# Altium schematic sheet PrintNC_CNC_Breakout.SchDoc
size C; Author: AM; CompanyName: Expatria Technologies; DrawnBy: A.Marles; Engineer: AM; Organization: Expatria Technologies; Address1: Schematic; Address2: 101 Main Street, 14th Floor; Address3: Cambridge, MA 02142; Address4: USA; DocumentNumber: 3; SheetNumber: 3; SheetTotal: 14; PCB_Rev: A1
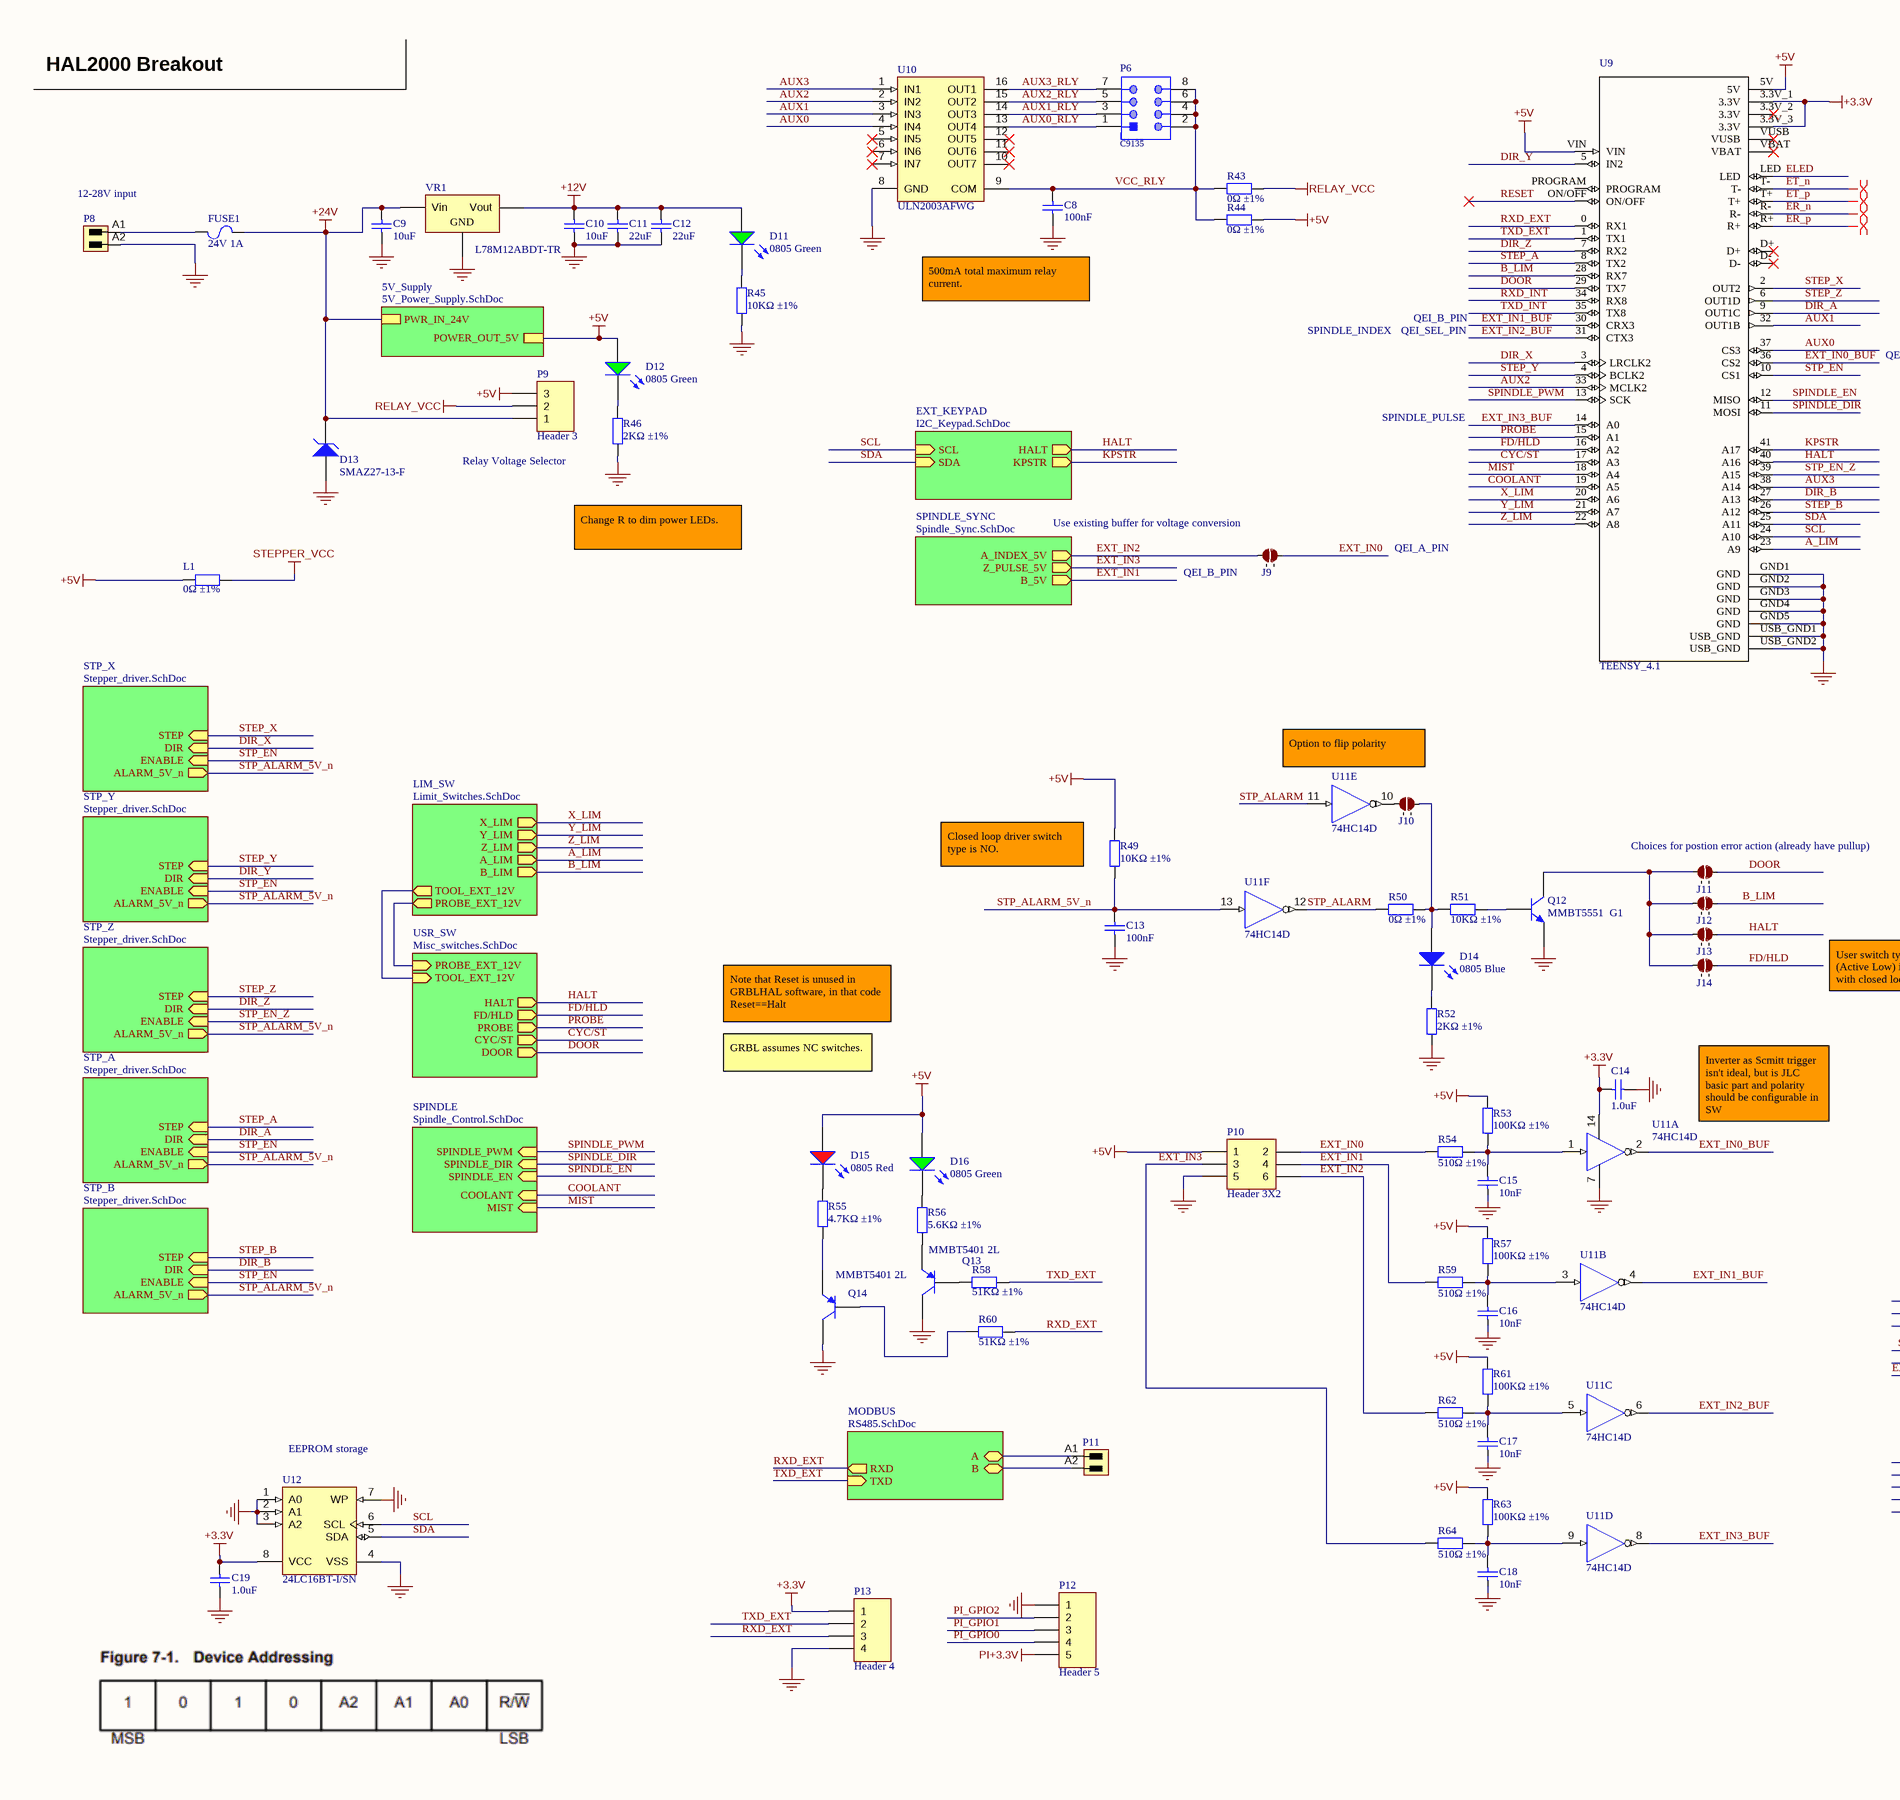
[diagram p0: PrintNC_CNC_Breakout.SchDoc, left]
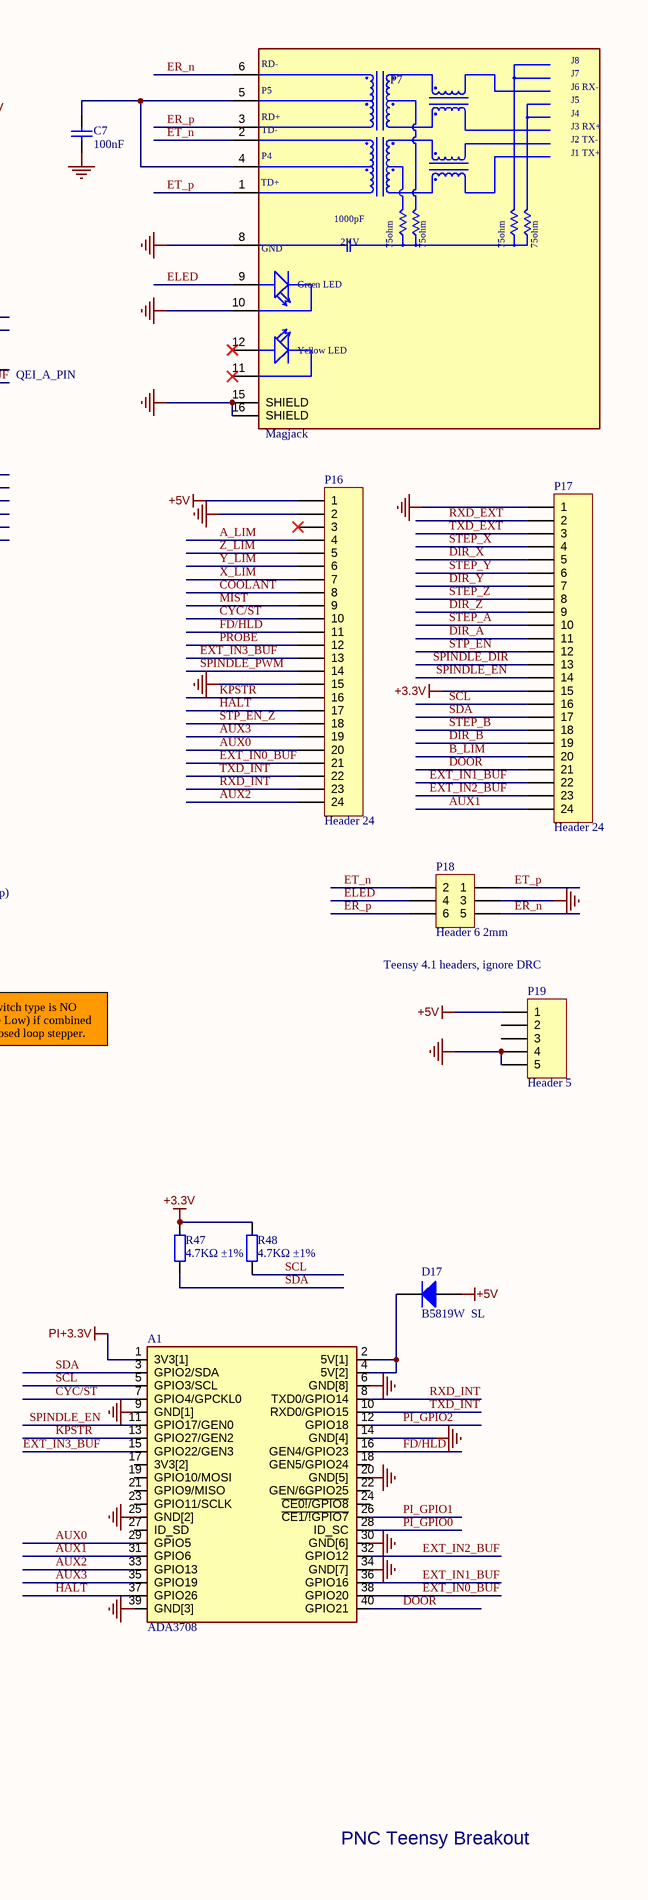
[diagram p1: PrintNC_CNC_Breakout.SchDoc, right]

## Parts
A1  ADA3708  [ADA3708_RPI-ZERO]
C7  100nF  [1206_C]
C8  100nF  [0603_C]
C9  10uF  [1206_C]
C10  10uF  [1206_C]
C11  22uF  [0805_C]
C12  22uF  [0805_C]
C13  100nF  [0402_C]
C14  1.0uF  [0402_C]
C15  10nF  [0402_C]
C16  10nF  [0402_C]
C17  10nF  [0402_C]
C18  10nF  [0402_C]
C19  1.0uF  [0402_C]
D11  0805 Green  [0805_LED_S1]
D12  0805 Green  [0805_LED_S1]
D13  SMAZ27-13-F  [DIOM5226X240N]
D14  0805 Blue  [0805_LED_S1]
D15  0805 Red  [0805_LED_S1]
D16  0805 Green  [0805_LED_S1]
D17  B5819W  SL  [SOD-123]
FUSE1  24V 1A  [1206_C]
J9  2 way net solder junction - Normally Open  [2waySolder_NO]  (value not drawn)  (no BOM)
J10  2 way net solder junction - Normally Open  [2waySolder_NO]  (value not drawn)  (no BOM)
J11  2 way net solder junction - Normally Open  [2waySolder_NO]  (value not drawn)  (no BOM)
J12  2 way net solder junction - Normally Open  [2waySolder_NO]  (value not drawn)  (no BOM)
J13  2 way net solder junction - Normally Open  [2waySolder_NO]  (value not drawn)  (no BOM)
J14  2 way net solder junction - Normally Open  [2waySolder_NO]  (value not drawn)  (no BOM)
L1  0Ω ±1%  [0402_R]
P6  C9135  [61200821621]
P7  Magjack  [HANRUN_HR911105A]
P8  (no value)  [SL_3_50_180G_02]
P9  Header 3  [HDR1X3]
P10  Header 3X2  [HDR2X3]
P11  (no value)  [SL_3_50_180G_02]
P12  Header 5  [HDR1X5]
P13  Header 4  [HDR1X4]  (no BOM)
P16  Header 24  [HDR1X24]  (no BOM)
P17  Header 24  [HDR1X24]  (no BOM)
P18  Header 6 2mm  [HDR2X3 - 2mm]
P19  Header 5  [HDR1X5]  (no BOM)
Q12  MMBT5551  G1  [SOT-23(SOT-23-3)]
Q13  MMBT5401 2L  [SOT-23(SOT-23-3)]
Q14  MMBT5401 2L  [SOT-23(SOT-23-3)]
R43  0Ω ±1%  [0402_R]
R44  0Ω ±1%  [0402_R]  (no BOM)
R45  10KΩ ±1%  [0402_R]
R46  2KΩ ±1%  [0402_R]
R47  4.7KΩ ±1%  [0402_R]
R48  4.7KΩ ±1%  [0402_R]
R49  10KΩ ±1%  [0402_R]
R50  0Ω ±1%  [0402_R]
R51  10KΩ ±1%  [0402_R]
R52  2KΩ ±1%  [0402_R]
R53  100KΩ ±1%  [0402_R]
R54  510Ω ±1%  [0402_R]
R55  4.7KΩ ±1%  [0402_R]
R56  5.6KΩ ±1%  [0402_R]
R57  100KΩ ±1%  [0402_R]
R58  51KΩ ±1%  [0402_R]
R59  510Ω ±1%  [0402_R]
R60  51KΩ ±1%  [0402_R]
R61  100KΩ ±1%  [0402_R]
R62  510Ω ±1%  [0402_R]
R63  100KΩ ±1%  [0402_R]
R64  510Ω ±1%  [0402_R]
U9  TEENSY_4.1  [TEENSY4-1]  (no BOM)
U10  ULN2003AFWG  [SOIC-16_150mil]
U11  74HC14D  [SOIC-14_150mil]  (parts A,B,C,D,E,F of 6)
U12  24LC16BT-I/SN  [SOIC-SN8_L]
VR1  L78M12ABDT-TR  [TO-252-2-180]

## Sub-sheets
5V_Supply = 5V_Power_Supply.SchDoc: POWER_OUT_5V, PWR_IN_24V
EXT_KEYPAD = I2C_Keypad.SchDoc: HALT (out), SCL (in), KPSTR (out), SDA (in)
LIM_SW = Limit_Switches.SchDoc: Y_LIM (out), Z_LIM (out), X_LIM (out), A_LIM (out), B_LIM (out), TOOL_EXT_12V (out), PROBE_EXT_12V (out)
MODBUS = RS485.SchDoc: A (bidir), B (bidir), RXD (out), TXD (in)
SPINDLE = Spindle_Control.SchDoc: SPINDLE_DIR (in), COOLANT (in), SPINDLE_PWM (in), SPINDLE_EN (in), MIST (in)
SPINDLE_SYNC = Spindle_Sync.SchDoc: Z_PULSE_5V (out), A_INDEX_5V (out), B_5V (out)
STP_A = Stepper_driver.SchDoc: ALARM_5V_n (out), STEP (in), DIR (in), ENABLE (in)
STP_B = Stepper_driver.SchDoc: STEP (in), DIR (in), ENABLE (in), ALARM_5V_n (out)
STP_X = Stepper_driver.SchDoc: ALARM_5V_n (out), STEP (in), DIR (in), ENABLE (in)
STP_Y = Stepper_driver.SchDoc: ALARM_5V_n (out), STEP (in), DIR (in), ENABLE (in)
STP_Z = Stepper_driver.SchDoc: ALARM_5V_n (out), STEP (in), DIR (in), ENABLE (in)
USR_SW = Misc_switches.SchDoc: HALT (out), FD/HLD (out), PROBE (out), CYC/ST (out), DOOR (out), TOOL_EXT_12V (in), PROBE_EXT_12V (in)

## Nets
+3.3V: C14.1 C19.2 P13.1 P17.15 R47.2 R48.2 U9.3.3V_1(3.3V) U9.3.3V_3(3.3V) U11.14(VDD) U12.8(VCC)
+5V: D12.A D15.A D16.A D17.1(A) L1.1 P9.3 P10.1 P16.1 P19.1 R44.1 R49.2 R53.2 R57.2 R61.2 R63.2 U9.5V U9.VIN ; sheet 5V_Supply/POWER_OUT_5V
+12V: C10.2 C11.2 C12.2 D11.A VR1.3(Vout)
+24V: C9.2 D13.2(K) FUSE1.2 P9.1 VR1.1(Vin) ; sheet 5V_Supply/PWR_IN_24V
GND: A1.6(GND[8]) A1.9(GND[1]) A1.14(GND[4]) A1.20(GND[5]) A1.25(GND[2]) A1.30(GND[6]) A1.34(GND[7]) A1.39(GND[3]) C7.1 C8.1 C9.1 C10.1 C11.1 C12.1 C13.1 C14.2 C15.1 C16.1 C17.1 C18.1 C19.1 D13.1(A) P7.8(GND) P7.10(GC) P7.15(SHIELD) P7.16(SHIELD) P8.A2 P10.5 P12.1 P13.4 P16.2 P16.15 P17.1 P18.3 P19.4 P19.5 Q12.2(E) Q13.3(C) Q14.3(C) R45.1 R46.1 R52.1 U9.GND1(GND) U9.GND2(GND) U9.GND3(GND) U9.GND4(GND) U9.GND5(GND) U9.USB_GND1(USB_GND) U9.USB_GND2(USB_GND) U10.8(GND) U11.7(GND) U12.1(A0) U12.2(A1) U12.3(A2) U12.4(VSS) U12.7(WP) VR1.2(GND)
PI+3.3V: A1.1(3V3[1]) P12.5
RELAY_VCC: P9.2 R43.1
STEPPER_VCC: L1.2
A_LIM: P16.4 U9.23(A9) ; sheet LIM_SW/A_LIM
AUX0: A1.29(GPIO5) P16.20 U9.37(CS3) U10.4(IN4)
AUX0_RLY: P6.1 U10.13(OUT4)
AUX1: A1.31(GPIO6) P17.24 U9.32(OUT1B) U10.3(IN3)
AUX1_RLY: P6.3 U10.14(OUT3)
AUX2: A1.33(GPIO13) P16.24 U9.33(MCLK2) U10.2(IN2)
AUX2_RLY: P6.5 U10.15(OUT2)
AUX3: A1.35(GPIO19) P16.19 U9.38(A14) U10.1(IN1)
AUX3_RLY: P6.7 U10.16(OUT1)
B_LIM: J12.2 P17.20 U9.28(RX7) ; sheet LIM_SW/B_LIM
COOLANT: P16.8 U9.19(A5) ; sheet SPINDLE/COOLANT
CYC/ST: A1.7(GPIO4/GPCKL0) P16.10 U9.17(A3) ; sheet USR_SW/CYC/ST
DIR_A: P17.11 U9.9(OUT1C) ; sheet STP_A/DIR
DIR_B: P17.19 U9.27(A13) ; sheet STP_B/DIR
DIR_X: P17.5 U9.3(LRCLK2) ; sheet STP_X/DIR
DIR_Y: P17.7 U9.5(IN2) ; sheet STP_Y/DIR
DIR_Z: P17.9 U9.7(RX2) ; sheet STP_Z/DIR
DOOR: A1.40(GPIO21) J11.2 P17.21 U9.29(TX7) ; sheet USR_SW/DOOR
ELED: P7.9(GA) P18.4 U9.LED
ER_n: P7.6(RD-) P18.5 U9.R-
ER_p: P7.3(RD+) P18.6 U9.R+
ET_n: P7.2(TD-) P18.2 U9.T-
ET_p: P7.1(TD+) P18.1 U9.T+
EXT_IN0: J9.2 P10.2 R54.1
EXT_IN0_BUF: A1.38(GPIO20) P16.21 U9.36(CS2) U11.2(Y)
EXT_IN1: P10.4 R59.1 ; sheet SPINDLE_SYNC/B_5V
EXT_IN1_BUF: A1.36(GPIO16) P17.22 U9.30(CRX3) U11.4(Y)
EXT_IN2: J9.1 P10.6 R62.1 ; sheet SPINDLE_SYNC/A_INDEX_5V
EXT_IN2_BUF: A1.32(GPIO12) P17.23 U9.31(CTX3) U11.6(Y)
EXT_IN3: P10.3 R64.1 ; sheet SPINDLE_SYNC/Z_PULSE_5V
EXT_IN3_BUF: A1.15(GPIO22/GEN3) P16.13 U9.14(A0) U11.8(Y)
FD/HLD: A1.16(GEN4/GPIO23) J14.2 P16.11 U9.16(A2) ; sheet USR_SW/FD/HLD
HALT: A1.37(GPIO26) J13.2 P16.17 U9.40(A16) ; sheet USR_SW/HALT, sheet EXT_KEYPAD/HALT
KPSTR: A1.13(GPIO27/GEN2) P16.16 U9.41(A17) ; sheet EXT_KEYPAD/KPSTR
MIST: P16.9 U9.18(A4) ; sheet SPINDLE/MIST
PI_GPIO0: A1.28(ID_SC) P12.4
PI_GPIO1: A1.26(~{CE1/!GPIO7}) P12.3
PI_GPIO2: A1.12(GPIO18) P12.2
PROBE: P16.12 U9.15(A1) ; sheet USR_SW/PROBE
RESET: U9.ON/OFF
RXD_EXT: P13.3 P17.2 R60.1 U9.0(RX1) ; sheet MODBUS/RXD
RXD_INT: A1.8(TXD0/GPIO14) P16.23 U9.34(RX8)
SCL: A1.5(GPIO3/SCL) P17.16 R48.1 U9.24(A10) U12.6(SCL) ; sheet EXT_KEYPAD/SCL
SDA: A1.3(GPIO2/SDA) P17.17 R47.1 U9.25(A11) U12.5(SDA) ; sheet EXT_KEYPAD/SDA
SPINDLE_DIR: P17.13 U9.11(MOSI) ; sheet SPINDLE/SPINDLE_DIR
SPINDLE_EN: A1.11(GPIO17/GEN0) P17.14 U9.12(MISO) ; sheet SPINDLE/SPINDLE_EN
SPINDLE_PWM: P16.14 U9.13(SCK) ; sheet SPINDLE/SPINDLE_PWM
STEP_A: P17.10 U9.8(TX2) ; sheet STP_A/STEP
STEP_B: P17.18 U9.26(A12) ; sheet STP_B/STEP
STEP_X: P17.4 U9.2(OUT2) ; sheet STP_X/STEP
STEP_Y: P17.6 U9.4(BCLK2) ; sheet STP_Y/STEP
STEP_Z: P17.8 U9.6(OUT1D) ; sheet STP_Z/STEP
STP_ALARM: R50.2 U11.11(A) U11.12(Y)
STP_ALARM_5V_n: C13.2 R49.1 U11.13(A) ; sheet STP_X/ALARM_5V_n, sheet STP_Y/ALARM_5V_n, sheet STP_Z/ALARM_5V_n, sheet STP_A/ALARM_5V_n, sheet STP_B/ALARM_5V_n
STP_EN: P17.12 U9.10(CS1) ; sheet STP_X/ENABLE, sheet STP_Y/ENABLE, sheet STP_A/ENABLE, sheet STP_B/ENABLE
STP_EN_Z: P16.18 U9.39(A15) ; sheet STP_Z/ENABLE
TXD_EXT: P13.2 P17.3 R58.2 U9.1(TX1) ; sheet MODBUS/TXD
TXD_INT: A1.10(RXD0/GPIO15) P16.22 U9.35(TX8)
VCC_RLY: C8.2 P6.2 P6.4 P6.6 P6.8 R43.2 R44.2 U10.9(COM)
X_LIM: P16.7 U9.20(A6) ; sheet LIM_SW/X_LIM
Y_LIM: P16.6 U9.21(A7) ; sheet LIM_SW/Y_LIM
Z_LIM: P16.5 U9.22(A8) ; sheet LIM_SW/Z_LIM
NetA1_2: A1.2(5V[1]) A1.4(5V[2]) D17.2(K)
NetC7_2: C7.2 P7.4(P4) P7.5(P5)
NetC15_2: C15.2 R53.1 R54.2 U11.1(A)
NetC16_2: C16.2 R57.1 R59.2 U11.3(A)
NetC17_2: C17.2 R61.1 R62.2 U11.5(A)
NetC18_2: C18.2 R63.1 R64.2 U11.9(A)
NetD11_K: D11.K R45.2
NetD12_K: D12.K R46.2
NetD14_A: D14.A J10.2 R50.1 R51.1
NetD14_K: D14.K R52.2
NetD15_K: D15.K R55.2
NetD16_K: D16.K R56.2
NetFUSE1_1: FUSE1.1 P8.A1
NetJ10_1: J10.1 U11.10(Y)
NetJ11_1: J11.1 J12.1 J13.1 J14.1 Q12.3(C)
NetP11_A1: P11.A1 ; sheet MODBUS/A
NetP11_A2: P11.A2 ; sheet MODBUS/B
NetQ12_1: Q12.1(B) R51.2
NetQ13_1: Q13.1(B) R58.1
NetQ13_2: Q13.2(E) R56.1
NetQ14_1: Q14.1(B) R60.2
NetQ14_2: Q14.2(E) R55.1
(unnamed): sheet LIM_SW/TOOL_EXT_12V, sheet USR_SW/TOOL_EXT_12V
(unnamed): sheet LIM_SW/PROBE_EXT_12V, sheet USR_SW/PROBE_EXT_12V

Not connected (* = marked no-connect by the designer): A1 17(3V3[2]) 18(GEN5/GPIO24) 19(GPIO10/MOSI) 21(GPIO9/MISO) 22(GEN/6GPIO25) 23(GPIO11/SCLK) 24(~{CE0!/GPIO8}) 27(ID_SD); P7 11(YC)* 12(YA)*; P16 3*; P19 2 3; U9 3.3V_2(3.3V)* D+* D-* PROGRAM VBAT* VUSB*; U10 5(IN5)* 6(IN6)* 7(IN7)* 10(OUT7)* 11(OUT6)* 12(OUT5)*

## Layout directives
differential pair: ER_n, ER_p, ET_n, ET_p

## Notes on the sheet
- HAL2000 Breakout
- (near P8) 12-28V input
- 500mA total maximum relay current.
- SPINDLE_INDEX
- QEI_SEL_PIN
- QEI_B_PIN
- QEI_A_PIN
- SPINDLE_PULSE
- Relay Voltage Selector
- (near J9) Use existing buffer for voltage conversion
- Change R to dim power LEDs.
- (near J9) QEI_B_PIN
- Option to flip polarity
- (near R49) Closed loop driver switch type is NO.
- (near J11) Choices for postion error action (already have pullup)
- Teensy 4.1 headers, ignore DRC
- Note that Reset is unused in GRBLHAL software, in that code Reset==Halt
- User switch type is NO (Active Low) if combined with closed loop stepper.
- GRBL assumes NC switches.
- Inverter as Scmitt trigger isn't ideal, but is JLC basic part and polarity should be configurable in SW
- (near U12) EEPROM storage
- PNC Teensy Breakout
- Expatria Technologies
- SHEET
- PROJECT
- REV
- 1136 Glade Court
- Port Coquitlam, BC V3B 1R5
- EMAIL: INFO@EXPATRIA.CA
- SIZE
- ENGR
- C
- MODIFIED
- DOCUMENT
- /
- Copyright Expatria Technologies 2021.  This document describes Open Hardware and is licensed under the CERN-OHL-P  v2.  No warranty is implied or expressed.
- (in symbol HR911105A) J8; J7; J6 RX-; J5; J4; J3 RX+; J2 TX-; J1 TX+; 1000pF; 2KV; 75ohm; Green LED; Yellow LED

## Library data of the parts
A1 = ADA3708: Raspberry Pi Zero WH _Zero W with Headers_; MP: ADA3708; Availability: Unavailable; Package: None; MF: Raspberry Pi; Value: *; Price: None; SnapEDA_Link: https://www.snapeda.com/parts/ADA3708/Raspberry%20Pi/view-part/2770118/?ref=snap; SuppliersPartNumber: C429949
C7 = 1206 100nF (104) 10% 50V: Chip capacitors; Manufacturer: Samsung Electro-Mechanics; PartNumber: CL31B104KBCNNNC; Tolerance: 10%; Voltage: 50V; Package: 1206; Supplier: LC; SuppliersPartNumber: C24497; Capacitance: 100nF
C8 = 0603 100nF (104) 10% 50V: Chip capacitors; Manufacturer: YAGEO; PartNumber: CC0603KRX7R9BB104; Tolerance: 10%; Voltage: 50V; Package: 0603; Supplier: LC; SuppliersPartNumber: C14663; Capacitance: 100nF
C9 C10 = 1206 10uF (106) 10% 50V: Chip capacitors; Manufacturer: Samsung Electro-Mechanics; PartNumber: CL31A106KBHNNNE; Tolerance: 10%; Voltage: 50V; Package: 1206; Supplier: LC; SuppliersPartNumber: C13585; Capacitance: 10uF
C11 C12 = 0805 22uF (226) 20% 25V: Chip capacitors; Manufacturer: Samsung Electro-Mechanics; PartNumber: CL21A226MAQNNNE; Tolerance: 20%; Voltage: 25V; Package: 0805; Supplier: LC; SuppliersPartNumber: C45783; Capacitance: 22uF
C13 = 0402 100nF (104) 10% 16V: Chip capacitors; Manufacturer: Samsung Electro-Mechanics; PartNumber: CL05B104KO5NNNC; Tolerance: 10%; Voltage: 16V; Package: 0402; Supplier: LC; SuppliersPartNumber: C1525; Capacitance: 100nF
C14 C19 = 0402 1.0uF (105) 10% 25V: Chip capacitor; Manufacturer: Samsung Electro-Mechanics; PartNumber: CL05A105KA5NQNC; Capacitance: 1uF; Tolerance: 10%; Voltage: 25V; Package: 0402; Supplier: LC; SuppliersPartNumber: C52923
C15-C18 = 0402 10nF (103) 10% 50V: Chip capacitors; Manufacturer: Samsung Electro-Mechanics; PartNumber: CL05B103KB5NNNC; Tolerance: 10%; Voltage: 50V; Package: 0402; Supplier: LC; SuppliersPartNumber: C15195; Capacitance: 10nF
D11 D12 D16 = 0805 LED Green: LED; Package: 0805; Supplier: LC; SuppliersPartNumber: C2297; Color: Green
D13 = BZT52C27: 27V ±5% 1W 500nA @ 20.5V SMA(DO-214AC) Zener Diodes RoHS; Package: SMA(DO-214AC); Supplier: LC; SuppliersPartNumber: C155318
D14 = 0805 LED Blue: LED; Package: 0805; Supplier: LC; SuppliersPartNumber: C2293; Color: Blue
D15 = 0805 LED Red: LED; PartNumber: FC-2012HRK-620D; Manufacturer: Foshan NationStar Optoelectronics; Package: 0805; Supplier: LC; SuppliersPartNumber: C84256; Color: Red
D17 = SOD-123 B5819W  SL: 肖特基二极管; Package: SOD-123; Supplier: LC; SuppliersPartNumber: C8598
FUSE1 = JK-nSMD050-24: 24V 1A 0.1s 1206 PTC Resettable Fuses RoHS; Manufacturer: Jinrui Electronic Materials Co.; Package: 1206; Supplier: LC; SuppliersPartNumber: C369160; PartNumber: JK-nSMD050-24
J9-J14 = 2waySolderNO
L1 R43 R44 R50 = 0402 0R (0R0) 1%: Chip resistor; Manufacturer: Uniroyal Elec; PartNumber: 0402WGF0000TCE; Power: 1/16W; Package: 0402; Supplier: LC; SuppliersPartNumber: C17168; Resistance: 0Ω; Tolerance: 1%
P6 = CMP-1502-00006-1: Male Box Header WR-BHD, THT, Vertical, pitch 2.54 mm, 8 pins; Manufacturer: Wurth Elektronik; Pitch: 2.54mm; Publisher: WurthElektronik; Part Number: C9135; Packaging: Tray; Published Date: August2018; Package Reference: 61200821621; SuppliersPartNumber: C9135
P7 = HR911105A: HR911105A Ethernet Interface Arduino Platform Evaluation Expansion Board; MF: DFRobot; SuppliersPartNumber: C163507; Package: None; Availability: Unavailable; MP: HR911105A; Value: *; Price: None
P8 P11 = CMP-1559-00901-1: Header,Male Pin,Covered(4 Sided) 2 1 0.138"（3.50mm） 2 P=3.5mm Pluggable System Terminal Block RoHS; PartNumber: WJ15EDGVC-3.5-2P; Manufacturer: Ningbo Kangnex Elec; UL_94_flammability_rating: V-0; Pitch_mm: 3.5 mm; Side_termination_characteristic: closed side; Pitch_inch: 0.138 inch; Solder_pin_length_mm: 3.2 mm; Short_text_for_material: SL 3.50/02/180G 3.2SN OR BX; Revision: V1; PackageReference: SL_3_50_180G_02; Packaging: Box; SuppliersPartNumber: C192777
P9 = Header 3: Header, 3-Pin; Publisher: Altium Limited; SuppliersPartNumber: C49257
P10 = Header 3X2: Header, 3-Pin, Dual row; Publisher: Altium Limited; SuppliersPartNumber: C65114
P12 P19 = Header 5: Header, 5-Pin; LatestRevisionDate: 17-Jul-2002; LatestRevisionNote: Re-released for DXP Platform.; Publisher: Altium Limited; SuppliersPartNumber: C124379
P13 = Header 4: Header, 4-Pin; Publisher: Altium Limited; SuppliersPartNumber: C124378
P16 P17 = Header 24: Header, 24-Pin; LatestRevisionDate: 17-Jul-2002; LatestRevisionNote: Re-released for DXP Platform.; Publisher: Altium Limited; SuppliersPartNumber: C725956
P18 = Header 6 2mm: Header, 6-Pin 2x3, 2mm pitch; LatestRevisionDate: 17-Jul-2002; LatestRevisionNote: Re-released for DXP Platform.; Publisher: Altium Limited; SuppliersPartNumber: C225288
Q12 = SOT-23 MMBT5551  G1: 三极管; Package: SOT-23; Supplier: LC; SuppliersPartNumber: C2145
Q13 Q14 = SOT-23 MMBT5401 2L: 三极管; Package: SOT-23; Supplier: LC; SuppliersPartNumber: C8326
R45 R49 R51 = 0402 10K (1002) 1%: Chip resistor; Manufacturer: Uniroyal Elec; PartNumber: 0402WGF1002TCE; Power: 1/16W; Package: 0402; Supplier: LC; SuppliersPartNumber: C25744; Resistance: 10KΩ; Tolerance: 1%
R46 R52 = 0402 2K (2001) 1%: Chip resistor; Manufacturer: Uniroyal Elec; PartNumber: 0402WGF2001TCE; Power: 1/16W; Package: 0402; Supplier: LC; SuppliersPartNumber: C4109; Resistance: 2KΩ; Tolerance: 1%
  R46: ComponentLink1Description: Supplier link; ComponentLink1URL: http://www.szlcsc.com/product/details_4516.html
R47 R48 R55 = 0402 4.7K (4701) 1%: Chip resistor; Manufacturer: Uniroyal Elec; PartNumber: 0402WGF4701TCE; Power: 1/16W; Package: 0402; Supplier: LC; SuppliersPartNumber: C25900; Resistance: 4.7KΩ; Tolerance: 1%
  R47 R48: ComponentLink1Description: Supplier link; ComponentLink1URL: http://www.szlcsc.com/product/details_26643.html
R53 R57 R61 R63 = 0402 100K (1003) 1%: Chip resistor; Manufacturer: Uniroyal Elec; PartNumber: 0402WGF1003TCE; Power: 1/16W; Package: 0402; Supplier: LC; SuppliersPartNumber: C25741; Resistance: 100KΩ; Tolerance: 1%
R54 R59 R62 R64 = 0402 510R (5100) 1%: Chip resistor; Manufacturer: Uniroyal Elec; PartNumber: 0402WGF5100TCE; Power: 1/16W; Package: 0402; Supplier: LC; SuppliersPartNumber: C25123; Resistance: 510Ω; Tolerance: 1%
R56 = 0402 5.6K (5601) 1%: Chip resistor; Manufacturer: Uniroyal Elec; PartNumber: 0402WGF5601TCE; Power: 1/16W; Package: 0402; Supplier: LC; SuppliersPartNumber: C25908; Resistance: 5.6KΩ; Tolerance: 1%
R58 R60 = 0402 51K (5102) 1%: Chip resistor; Manufacturer: Uniroyal Elec; PartNumber: 0402WGF5102TCE; Power: 1/16W; Package: 0402; Supplier: LC; SuppliersPartNumber: C25794; Resistance: 51KΩ; Tolerance: 1%
U9 = DEV-16771: None; Package: None; Value: *
U10 = ULN2003AFWG_[C5437]: 大电流驱动; Package: SOIC-16_150mil; Supplier: LC; SuppliersPartNumber: C5437
U11 = 74HC14D_[C5605]: 74系列逻辑芯片; Package: SOIC-14_150mil; Supplier: LC; SuppliersPartNumber: C5605
U12 = CMP-0159-00216-1: IC EEPROM 16KBIT I2C 8SOIC; SuppliersPartNumber: C6480
VR1 = TO-252-2 L78M05ABDT-TR: DNI; Package: TO-252-2; Supplier: digikey; SuppliersPartNumber: C61534